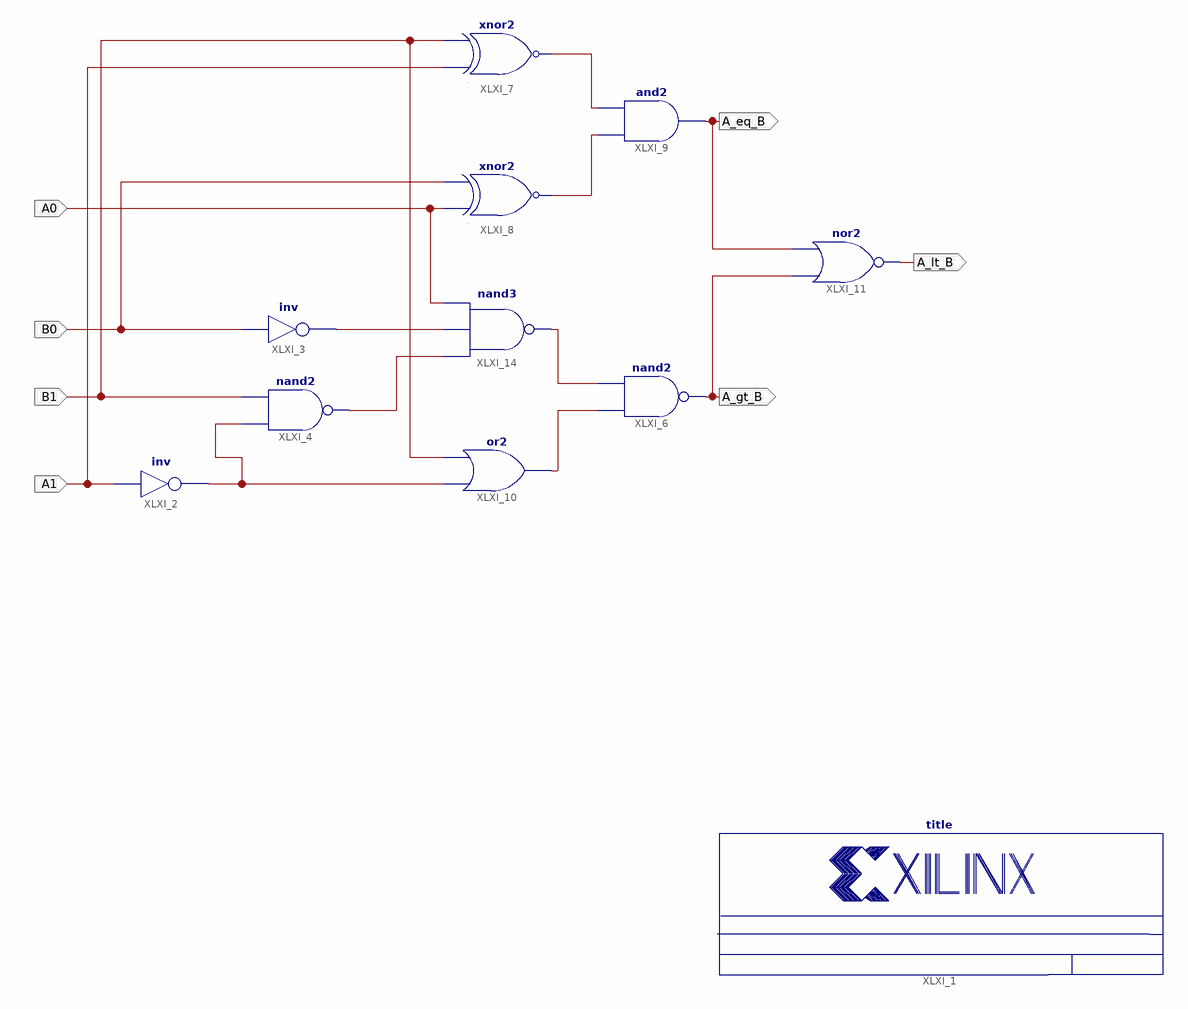
[diagram p0: schematic sheet 1]
// Xilinx ISE schematic fig_5_9.sch (spartan3e) as structural Verilog: 11 symbols, 7 ports
module fig_5_9 (
  input  B1,
  input  A1,
  input  B0,
  input  A0,
  output A_eq_B,
  output A_gt_B,
  output A_lt_B
);

  wire XLXN_3, XLXN_4, XLXN_5, XLXN_6, XLXN_7, XLXN_10, XLXN_21;

  title #(.TitleFieldText("Synthesis Synopsys Design Compiler 2bit comparator"), .NameFieldText("Figure 5.9")) XLXI_1 ();
  nand XLXI_6 (A_gt_B, XLXN_6, XLXN_5);
  or XLXI_10 (XLXN_6, XLXN_21, B1);
  nor XLXI_11 (A_lt_B, A_gt_B, A_eq_B);
  nand XLXI_14 (XLXN_5, XLXN_10, XLXN_7, A0);
  not XLXI_2 (XLXN_21, A1);
  not XLXI_3 (XLXN_7, B0);
  nand XLXI_4 (XLXN_10, XLXN_21, B1);
  and XLXI_9 (A_eq_B, XLXN_3, XLXN_4);
  xnor XLXI_7 (XLXN_4, A1, B1);
  xnor XLXI_8 (XLXN_3, A0, B0);
endmodule
